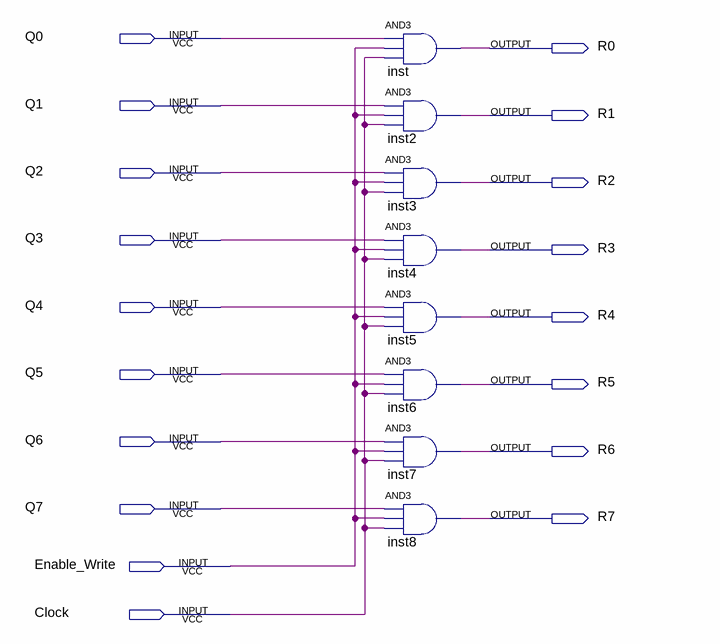
[diagram p0: schematic sheet]
// Quartus schematic 8_3AND.bdf as structural Verilog: 8 symbols, 18 pins
module \8_3AND  (
  input  Q0,
  input  Q1,
  input  Q2,
  input  Q3,
  input  Q4,
  input  Q5,
  input  Q6,
  input  Q7,
  input  Enable_Write,
  input  Clock,
  output R0,
  output R1,
  output R2,
  output R3,
  output R4,
  output R5,
  output R6,
  output R7
);

  and inst (R0, Q0, Enable_Write, Clock);
  and inst2 (R1, Q1, Enable_Write, Clock);
  and inst3 (R2, Q2, Enable_Write, Clock);
  and inst4 (R3, Q3, Enable_Write, Clock);
  and inst5 (R4, Q4, Enable_Write, Clock);
  and inst6 (R5, Q5, Enable_Write, Clock);
  and inst7 (R6, Q6, Enable_Write, Clock);
  and inst8 (R7, Q7, Enable_Write, Clock);
endmodule
